# Altium project USB-C Charger.PrjPcb
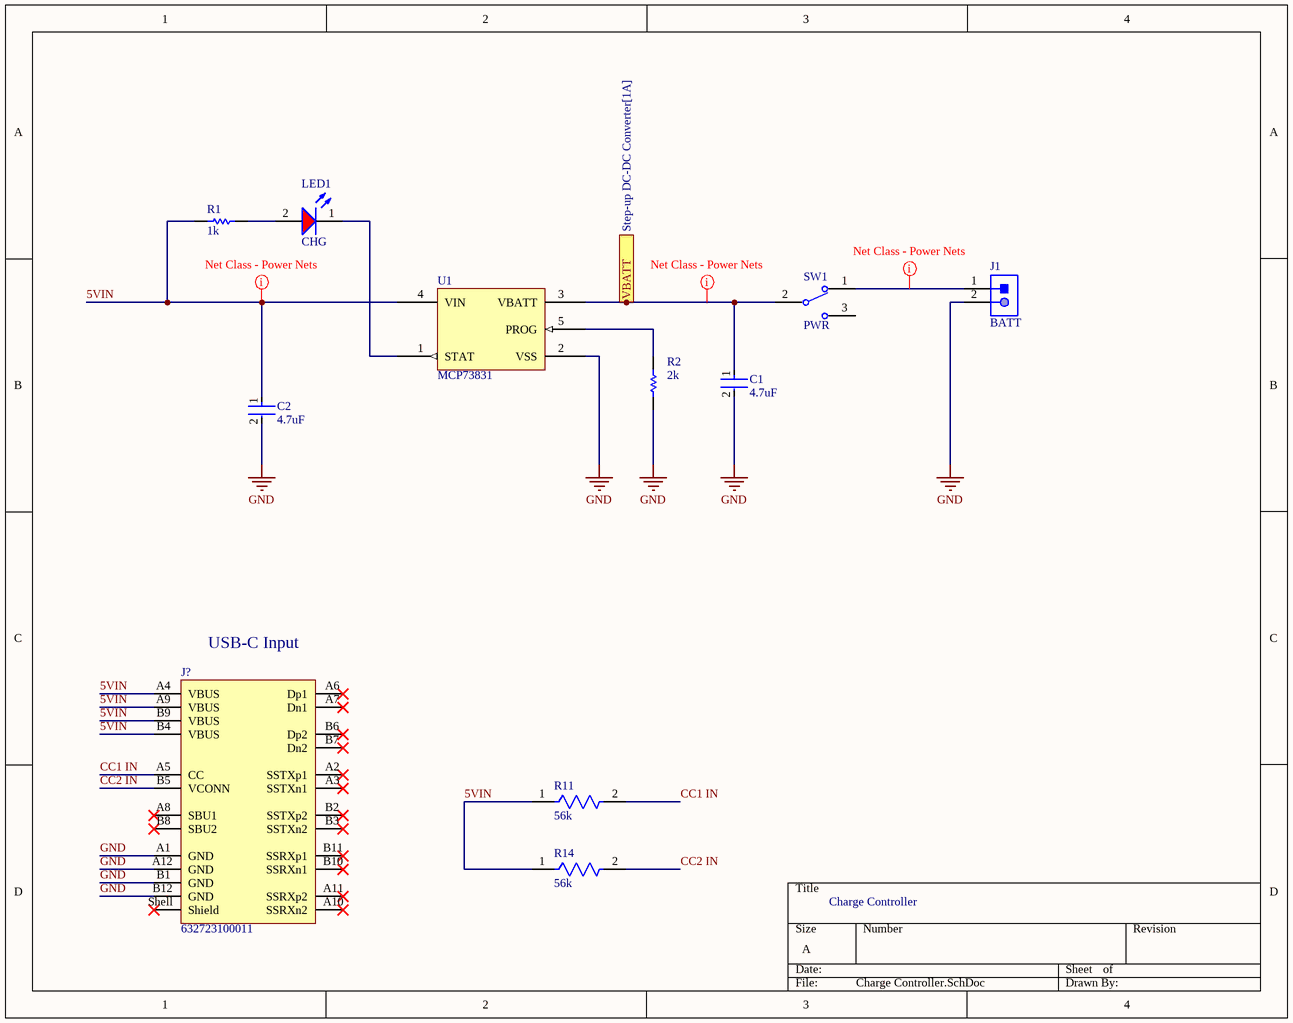
[diagram p0: Charge Controller.SchDoc]
2 sheets, 29 parts. Net scope: flat (ports and power ports of the same name join across sheets).
Board file: USB-C Charger.PcbDoc
Sheets:
  Charge Controller.SchDoc
  Step-up DC-DC Converter.SchDoc

## Sheet Charge Controller.SchDoc
size A; SheetNumber: 1; SheetTotal: 2

### Parts
C1  4.7uF  [FP-C0805C475K8PACTU-MFG]
C2  4.7uF  [FP-C0805C475K8PACTU-MFG]
IN  632723100011  [632723100011]
J1  BATT  [JST-S2B-PH-K-S_V]
LED1  CHG  [WL-SMCW_0805_150080xx75000]
R1  1k  [RESC2013X60X35ML10T20]
R2  2k  [RESC2013X60X35ML10T20]
R11  56k  [FP-CRCW0805-e3-IPC_B]
R14  56k  [FP-CRCW0805-e3-IPC_B]
SW1  PWR  [FP-JS102011JAQN-MFG]
U1  MCP73831  [SOT95P280X145-5N]

### Ports
VBATT (see Step-up DC-DC Converter[1A])

### Nets
GND: C1.2 C2.2 IN.A1(GND) IN.A12(GND) IN.B1(GND) IN.B12(GND) J1.2 R2.1 U1.2(VSS)
5VIN: C2.1 IN.A4(VBUS) IN.A9(VBUS) IN.B4(VBUS) IN.B9(VBUS) R1.1 R11.1 R14.1 U1.4(VIN)
CC1 IN: IN.A5(CC) R11.2
CC2 IN: IN.B5(VCONN) R14.2
NetC1_1: C1.1 SW1.2(C) U1.3(VBATT) ; port VBATT
NetJ1_1: J1.1 SW1.1
NetLED1_1: LED1.1(K) U1.1(STAT)
NetLED1_2: LED1.2(A) R1.2
NetR2_2: R2.2 U1.5(PROG)

Not connected (* = marked no-connect by the designer): IN A2(SSTXp1)* A3(SSTXn1)* A6(Dp1)* A7(Dn1)* A8(SBU1)* A10(SSRXn2)* A11(SSRXp2)* B2(SSTXp2)* B3(SSTXn2)* B6(Dp2)* B7(Dn2)* B8(SBU2)* B10(SSRXn1)* B11(SSRXp1)* Shell(Shield)*; SW1 3

### Layout directives
net class PowerNets: 5VIN, NetC1_1, NetJ1_1

### Notes on the sheet
- (near IN) USB-C Input
- Charge Controller

### Library data of the parts
C1 C2 = CMP-2007-01007-2: CAP CER 4.7UF 10V X5R 0805; Dielectric Material: Ceramic; Dissipation Factor: 5%; Tolerance: 10%; Lead Pitch: 0.75mm; Mount: Surface Mount; Voltage Rating (DC): 10V; Length: 2mm; Case Code (Imperial): 0805; Height: 1.25mm; Package Quantity: 1; Thickness: 0.055inch; Depth: 1.25mm; Case Code (Metric): 2012; Termination: SMD/SMT; Construction: Flat; Dielectric: X5R; Series: C; Capacitance: 4.7uF; Width: 1.2mm; Max Operating Temperature: 85°C; Packaging: Tape and Reel; Voltage Rating: 10V; REACH SVHC: No SVHC; Min Operating Temperature: -55°C; Number of Pins: 2; Case/Package: 0805; Radiation Hardening: No; Lead Free: Lead Free; Voltage: 10V; RoHS Compliant: Yes
IN = CMP-1502-03213-3: NexarPartId: 68112674; Voltage Rating: 20V; Gender: Receptacle; Current Rating: 5A; Pin Length: 1.5mm; Contact Resistance: 30mΩ; Connector Type: USB; USB Standard: USB 3.1; Insulation Resistance: 1GΩ; Number of Contacts: 24
J1 = CMP-1755-00004-1: Male Header, Pitch 2 mm, 1 x 2 Position, Height 4.8 mm, Tail Length 3.4 mm, -25 to 85 degC, RoHS, Bulk; Case\Package: Radial; Tolerance: 20%; Capacitance: 10 uF; Voltage Rating (DC): 50 V; Packaging: Bulk; ComponentLink1URL: http://www.jst-mfg.com/product/pdf/eng/ePH.pdf; Radiation Hardening: No; Height: 11 mm; Package Quantity: 200; PackageDescription: Male Header, Pitch 2 mm, 1 x 2 Position, Height 4.8 mm, Tail Length 3.4 mm; PackageReference: S2B-PH-K-S; Diameter: 5 mm; Pins: 2; Mount: Through Hole; Max Operating Temperature: 85 degC; Min Operating Temperature: -40 degC; ComponentLink1Description: Datasheet; DatasheetVersion: Dec-12; Length: 11 mm; Lead Pitch: 2 mm; REACH SVHC: No SVHC; Voltage Rating: 50 V; RoHSCompliant: true
LED1 = CMP-1426-00011-3: LED Uni-Color Red 630nm 2-Pin Chip 0805(2012Metric) T/R; Viewing Angle: 140°; Max Junction Temperature (Tj): 95°C; Power Dissipation: 72mW; Forward Current: 100mA; Forward Voltage: 2V; Wavelength: 625nm; Test Current: 20mA; Max Reverse Voltage (DC): 5V; Luminous Intensity: 150mcd; Lens Style: Clear, Rectangular; REACH SVHC: Unknown; Height: 700µm; Case Code (Metric): 2012; Peak Wavelength: 630nm; Length: 2mm; Width: 1.25mm; RoHS: Compliant; Packaging: Tape and Reel; Dominant Wavelength: 625nm; Color: Red; Case Code (Imperial): 0805; Min Operating Temperature: -40°C; Mount: Surface Mount; Max Operating Temperature: 85°C; Case/Package: 0805
R1 = CMP-2100-03671-1: Chip Resistor, 1 KOhm, +/- 1%, 125 mW, -55 to 155 degC, 0805 (2012 Metric), RoHS, Tape and Reel; Manufacturer: Yageo; Temperature Coefficient: 100ppm/degreesC; Voltage Rating (DC): 150V; Max Power Dissipation: 125mW; Resistance: 1KOhm; Number of Pins: 2; Number of Terminations: 2; Datasheet URL: http://www.yageo.com/NewPortal/yageodocoutput?fileName=/pdf/R-Chip/PYu-RC_Group_51_RoHS_L_5.pdf; Length: 0.079inch; Package Description: 2-Pin Surface Mounted Device, Body 2 x 1.25 mm; Depth: 1.25mm; Height: 0.024inch; Military Standard: Not; Case/Package: 0805; Package Reference: 0805; RoHSCompliant: true; Lead Free: LeadFree; Packaging: TapeandReel; Package Quantity: 1; Datasheet Version: Rev. 5, 10/2016; Tolerance: 1%; Min Operating Temperature: -55degC; Voltage Rating: 150V; Composition: ThickFilm; Case Code (Imperial): 0805; Power Rating: 125mW; Width: 0.049inch; Case Code (Metric): 2012; Manufacturer URL: http://www.yageo.com/; Max Operating Temperature: 155degC; REACH SVHC: Unknown; Termination: SMD/SMT
R2 = CMP-2001-01361-1: Manufacturer: Yageo; Part Number: RC0805JR-072KL
R11 R14 = CMP-2001-04015-2: RES Thick Film, 56kΩ, 1%, 0.125W, 100ppm/°C, 0805; Resistance: 56kR; Power Rating: 125mW; Voltage Rating: 150V; Depth: 1.25mm; Contact Plating: Tin; Package Quantity: 10; Min Operating Temperature: -55°C; Case/Package: 0805; Packaging: Tape and Reel; Lead Free: Lead Free; Case Code (Imperial): 0805; Tolerance: 1%; Height: 0.45mm; Max Operating Temperature: 155°C; Case Code (Metric): 2012; Number of Pins: 2; Width: 1.25mm; Mount: Surface Mount; Voltage Rating (DC): 150V; Max Power Dissipation: 125mW; Weight: 0.000194oz; Termination: SMD/SMT; Length: 2mm; Radiation Hardening: No; Composition: Thick Film; Features: Automotive AEC-Q200; Number of Terminations: 2; Temperature Coefficient: 100ppm/°C; Military Standard: Not
SW1 = CMP-10038-000001-1: SWITCH SLIDE SPDT 300MA 6V; Manufacturer: C&K; Manufacturer Part Number: JS102011JAQN; Contact Resistance: 70mΩ; Electromechanical Life: 5000Cycles; Device Class L2: Switches; Temperature Range Low: -40°C; Device Class L1: Electromechanical; RoHS: TRUE; Automotive: No; Throw Configuration: SPDT; Height: 3.5mm; Digikey Description: SWITCH SLIDE SPDT 300MA 6V; Device Class L3: Slide Switches; Temperature Range High: +85°C; Mouser Description: JS Series Sub-Miniature Slide Switch SPDT Right-Angle SMT; Mount: Surface Mount; ComponentLink2Description: Datasheet; Octopart: https://octopart.com/js102011jaqn-c%26k+components-74831566; Category: Switch; Contact Current Rating: 300mA; Temperature: -40°C to +85°C; Voltage Rating Dc: 6V; ComponentLink2URL: https://www.ckswitches.com/media/1422/js.pdf; Lead Free: Yes; Package: JS102011JAQN
U1 = MCP73831: Power Supply Support Circuit, Adjustable, 1 Channel, PDSO5; Manufacturer: Microchip; Manufacturer Part Number: MCP73831T-2ACI/OT; Package Body Material: Plastic; Adjustable Threshold: Yes; Number of Channels: 1; Package Equivalence Code: TSOP5/6,.11,37; Power Supplies: 3.3/5V; Supply Current-Max (Isup): 1.5mA; Max Supply Voltage: 6V; Min Supply Voltage: 3.75V; Time @ Peak Reflow Temperature-Max (s): 40s; Nominal Supply Voltage: 5.2V; Qualification Status: Not Qualified; Supplier: Arrow Electronics; Supplier Part Number: MCP73831T-2ACI/OT; RoHS: Yes; Category: Battery Management; Stock: 6000; Pricing: 3000=0.5836 (USD); Case/Package: LSSOP; Pins: 5; Package Shape: Rectangular; Terminal Finish: Tin; Min Operating Temperature: -40°C; Max Operating Temperature: 85°C; JESD-609 Code: e3; Throw Configuration: POWER SUPPLY SUPPORT CIRCUIT; JESD-30 Code: R-PDSO-G5; Moisture Sensitivity Level: 1; Channels: 1; Package Style: SMALL OUTLINE, LOW PROFILE, SHRINK PITCHMeter; Peak Reflow Temperature (Cel): 260°C; Surface Mount: Yes; Terminal Form: Gull Wing; Terminal Position: DUAL; Length: 2.95mm; Width: 1.65mm; Height - Seated (Max): 1.45mm; Terminal Pitch: 0.95mm; Temperature Grade: INDUSTRIAL; Reach SVHC Compliant: Yes; RoHS Compliant: Yes; ComponentLink1URL: https://datasheet.ciiva.com:443/pdfs/VipMasterIC/IC/MCHP/MCHPS05673/MCHPS05673-1.pdf?src-supplier=IHS+Markit; ComponentLink1Description: https://datasheet.ciiva.com:443/pdfs/VipMasterIC/IC/MCHP/MCHPS05673/MCHPS05673-1.pdf?src-supplier=IHS+Markit

## Sheet Step-up DC-DC Converter.SchDoc
size A; SheetNumber: 2; SheetTotal: 2
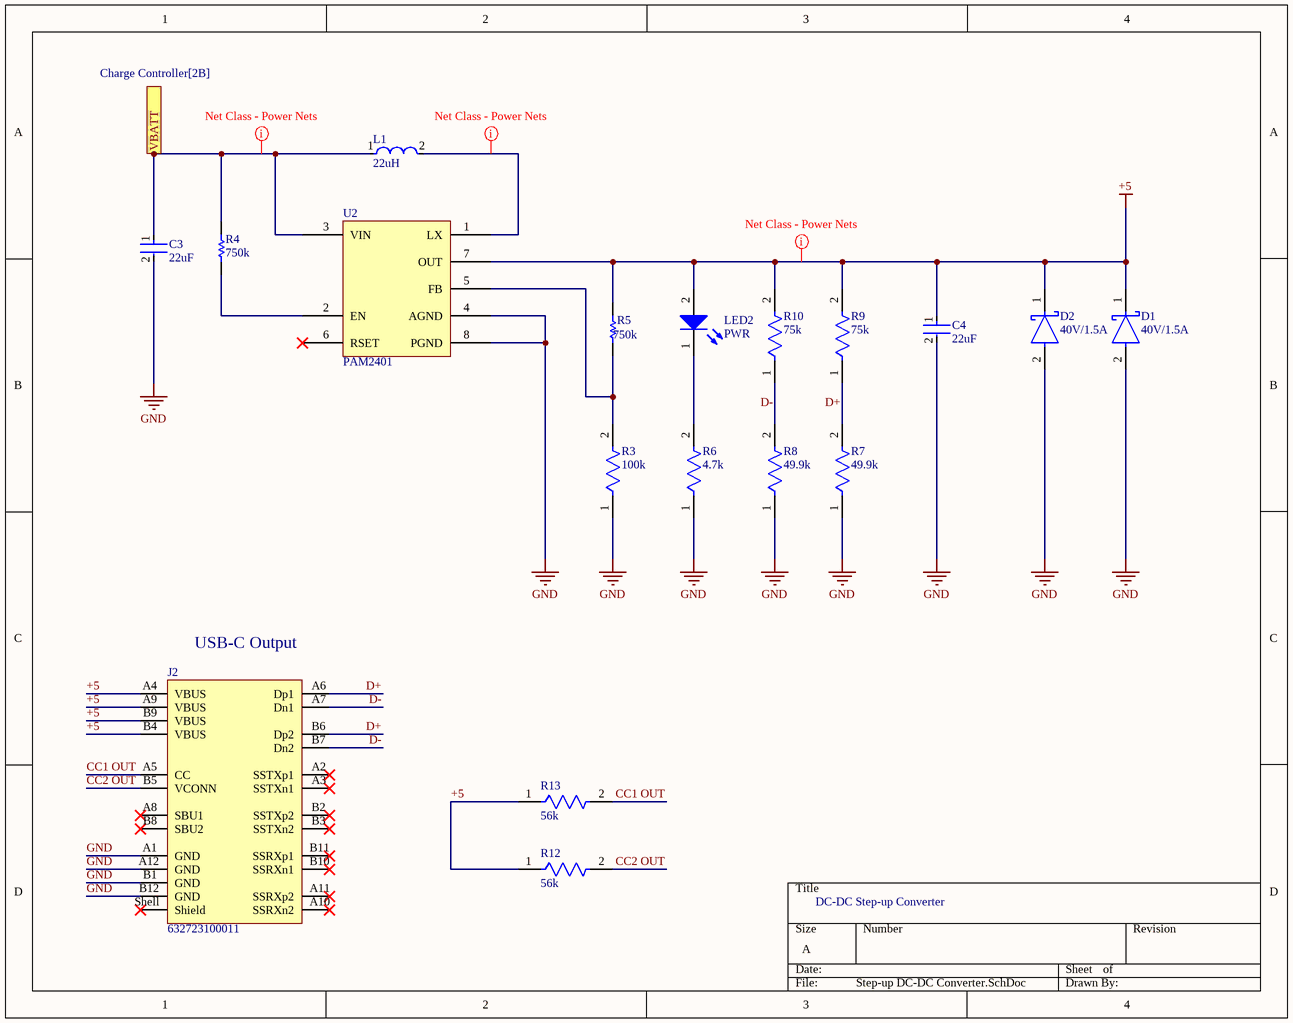
[diagram p1: Step-up DC-DC Converter.SchDoc]

### Parts
C3  22uF  [FP-GRM21B-0_15-MFG]
C4  22uF  [FP-GRM21B-0_15-MFG]
D1  40V/1.5A  [FP-95400-MFG]
D2  40V/1.5A  [FP-95400-MFG]
J2  632723100011  [632723100011]
L1  22uH  [FP-LQM2HPN_G0-IPC_C]
LED2  PWR  [WL-SMCW_0805_150080xx75000]
R3  100k  [FP-CRCW0805-e3-MFG]
R4  750k  [RESC2013X50X30LL20T20]
R5  750k  [RESC2013X50X30LL20T20]
R6  4.7k  [FP-CRCW0805-e3-IPC_B]
R7  49.9k  [FP-CRCW0805-e3-IPC_C]
R8  49.9k  [FP-CRCW0805-e3-IPC_C]
R9  75k  [FP-CRCW0805-e3-IPC_A]
R10  75k  [FP-CRCW0805-e3-IPC_A]
R12  56k  [FP-CRCW0805-e3-IPC_B]
R13  56k  [FP-CRCW0805-e3-IPC_B]
U2  PAM2401  [TSOP65P490X110-8N]

### Ports
VBATT (see Charge Controller[2B])

### Nets
+5: C4.1 D1.1(C) D2.1(C) J2.A4(VBUS) J2.A9(VBUS) J2.B4(VBUS) J2.B9(VBUS) LED2.2(A) R5.2 R9.2 R10.2 R12.1 R13.1 U2.7(OUT)
GND: C3.2 C4.2 D1.2(A) D2.2(A) J2.A1(GND) J2.A12(GND) J2.B1(GND) J2.B12(GND) R3.1 R6.1 R7.1 R8.1 U2.4(AGND) U2.8(PGND)
CC1 OUT: J2.A5(CC) R13.2
CC2 OUT: J2.B5(VCONN) R12.2
D+: J2.A6(Dp1) J2.B6(Dp2) R7.2 R9.1
D-: J2.A7(Dn1) J2.B7(Dn2) R8.2 R10.1
NetC1_1: C3.1 L1.1 R4.2 U2.3(VIN) ; port VBATT
NetL1_2: L1.2 U2.1(LX)
NetLED2_1: LED2.1(K) R6.2
NetR3_2: R3.2 R5.1 U2.5(FB)
NetR4_1: R4.1 U2.2(EN)

Not connected (* = marked no-connect by the designer): J2 A2(SSTXp1)* A3(SSTXn1)* A8(SBU1)* A10(SSRXn2)* A11(SSRXp2)* B2(SSTXp2)* B3(SSTXn2)* B8(SBU2)* B10(SSRXn1)* B11(SSRXp1)* Shell(Shield)*; U2 6(RSET)*

### Layout directives
net class PowerNets: +5, NetC1_1, NetL1_2

### Notes on the sheet
- (near J2) USB-C Output
- DC-DC Step-up Converter

### Library data of the parts
C3 C4 = CMP-2007-03385-2: Chip Multilayer Ceramic Capacitors for General Purpose, 0805, 22uF, X5R, 15%, 20%, 6.3V; Material: Ceramic; Max Operating Temperature: 85°C; Voltage: 6.3V; Min Operating Temperature: -55°C; Case/Package: 0805; Thickness: 0.053inch; Dielectric: X5R; Packaging: Tape and Reel; Depth: 1.25mm; Termination: SMD/SMT; Voltage Rating (DC): 6.3V; Radiation Hardening: No; Tolerance: 20%; Mount: Surface Mount; Lead Free: Lead Free; Package Quantity: 1; REACH SVHC: No SVHC; Voltage Rating: 6.3V; Capacitance: 22uF; Length: 2mm; Case Code (Imperial): 0805; Case Code (Metric): 2012; Width: 0.049inch; Height: 1.25mm
D1 D2 = CMP-02539-000025-1: DIODE SCHOTTKY 40V 1.5A SMA; Manufacturer: Vishay; Manufacturer Part Number: VS-15MQ040NTRPBF; Standoff Height: 0mm; Capacitance: 134pF; Peak Reverse Current: 0.5mA; Max Junction Temp: +150°C; Value: 134pF; Max Surge Forward Current: 140A; RoHS: TRUE; Lead Free: Yes; Octopart: https://octopart.com/vs-15mq040ntrpbf-vishay-44340959; Max Repetitive Reverse Voltage: 40V; Device Class L1: Discrete Semiconductors; ComponentLink2URL: http://www.vishay.com/docs/94141/vs-15mq040ntrpbf.pdf; Reverse Voltage: 40V; ComponentLink2Description: Datasheet; Forward Current: 1.5A; Temperature: -40°C to +150°C; Digikey Description: DIODE SCHOTTKY 40V 1.5A SMA; Height: 2.29mm; Category: Diode; Footprint Url: http://www.vishay.com/docs/95400/sma.pdf; Device Class L2: Diodes; Device Class L3: Schottky Diodes; Mouser Description: Schottky Diodes & Rectifiers 2.1 Amp 40 Volt; Automotive: No; Package: 95400; Temperature Range Low: -40°C; Temperature Range High: +150°C
J2 = CMP-1502-03213-3: as IN on sheet Charge Controller; Contact Material: Gold, Nickel; Max Operating Temperature: 105°C; Packaging: Tape and Reel; Height: 3.16mm; RoHS: Compliant; Orientation: Horizontal; Mount: Surface Mount, Through Hole; Number of Pins: 24; Min Operating Temperature: -40°C
L1 = CMP-06042-017002-1: Multilayer Type Inductor for Power Lines, 1008 (2520), 2.2μH, 20%, 0.225Ω, 1100mA; Current Rating: 1.1A; Test Frequency: 1MHz; Inductance: 2.2uH; Self Resonant Frequency: 40MHz; Shielding: Shielded; DC Resistance (DCR): 225mR; Length: 0.098inch; Package Quantity: 3000; Height - Seated (Max): 0.039inch; Packaging: Tape and Reel; Width: 0.079inch; Max Operating Temperature: 85°C; Tolerance: 20%; RoHS Compliant: Yes; Case/Package: 1008; Min Operating Temperature: -40°C; Mount: Surface Mount
LED2 = CMP-1426-00008-7: Led, Blue, 470 Nm, 3.2 V, 30 Ma, 145 Mcd Rohs Compliant: Yes; Dominant Wavelength: 470nm; Max Junction Temperature (Tj): 95°C; Power Dissipation: 105mW; Peak Wavelength: 465nm; Max Reverse Voltage (DC): 5V; Forward Current: 100mA; Test Current: 20mA; Luminous Intensity: 145mcd; Lens Style: Clear, Rectangular; Viewing Angle: 140°; Forward Voltage: 3.2V; Color: Blue; Height: 700µm; Case Code (Imperial): 0805; Width: 1.25mm; REACH SVHC: Unknown; Case/Package: 0805; Lead Free: Lead Free; Mount: Surface Mount; Packaging: Tape and Reel; RoHS: Compliant; Reverse Voltage: 5V; Min Operating Temperature: -40°C; Case Code (Metric): 2012; Wavelength: 470nm; Max Operating Temperature: 85°C; Length: 2mm
R3 = CMP-2001-04899-2: RES Thick Film, 100kΩ, 1%, 0.125W, 100ppm/°C, 0805; Resistance: 100kR; Power Rating: 125mW; Voltage Rating: 150V; Case/Package: 0805; Max Operating Temperature: 155°C; Case Code (Imperial): 0805; Lead Free: Lead Free; Weight: 0.000194oz; Number of Pins: 2; Package Quantity: 5000; Height: 0.45mm; Composition: Thick Film; Military Standard: Not; Tolerance: 1%; Case Code (Metric): 2012; Termination: SMD/SMT; Mount: Surface Mount; Radiation Hardening: No; Width: 1.25mm; Length: 2mm; Depth: 1.25mm; Packaging: Tape and Reel; Min Operating Temperature: -55°C; Contact Plating: Tin; Temperature Coefficient: 100ppm/°C; Voltage Rating (DC): 150V
R4 R5 = CMP-2001-04102-1: Manufacturer: Vishay Dale; Part Number: CRCW0805750KFKEA
R6 = CMP-2100-03615-2: RES Thick Film, 4.7kΩ, 1%, 0.125W, 100ppm/°C, 0805; Max Power Dissipation: 125mW; Resistance: 4.7kR; Voltage Rating: 150V; Termination: SMD/SMT; Weight: 0.000194oz; Case/Package: 0805; Number of Terminations: 2; Min Operating Temperature: -55°C; Case Code (Metric): 2012; Package Quantity: 10; Depth: 1.25mm; Military Standard: Not; Composition: Thick Film; Radiation Hardening: No; Contact Plating: Tin; Height: 0.45mm; Power Rating: 125mW; Features: Automotive AEC-Q200; Tolerance: 1%; Packaging: Tape and Reel; Max Operating Temperature: 155°C; Length: 2mm; Case Code (Imperial): 0805; Voltage Rating (DC): 150V; Width: 1.25mm; Temperature Coefficient: 100ppm/°C; Lead Free: Lead Free
R7 R8 = CMP-2001-03952-2: RES Thick Film, 49.9kΩ, 1%, 0.125W, 100ppm/°C, 0805; Resistance: 49.9kR; Power Rating: 125mW; Voltage Rating (DC): 150V; Contact Plating: Tin; Case Code (Imperial): 0805; Package Quantity: 10; Termination: SMD/SMT; Length: 2mm; Width: 0.049inch; Case Code (Metric): 2012; Temperature Coefficient: 100ppm/°C; Tolerance: 1%; Depth: 1.25mm; Mount: Surface Mount; Lead Free: Lead Free; Min Operating Temperature: -55°C; Case/Package: 0805; Number of Terminations: 2; Composition: Thick Film; Height: 0.45mm; Voltage Rating: 150V; Max Power Dissipation: 125mW; Features: Automotive AEC-Q200; Military Standard: Not; Radiation Hardening: No; Max Operating Temperature: 155°C; Weight: 0.000194oz; Packaging: Tape and Reel
R9 R10 = CMP-2001-04106-2: RES Thick Film, 75kΩ, 1%, 0.125W, 100ppm/°C, 0805; Voltage Rating: 150V; Power Rating: 125mW; Resistance: 75kR; Series: CRCW; Packaging: Tape and Reel; Width: 0.049inch; Package Quantity: 10; Max Operating Temperature: 155°C; Height: 0.45mm; Temperature Coefficient: 100ppm/°C; Resistor Type: Thick Film; Case Code (Metric): 2012; RoHS Compliant: Yes; Military Standard: Not; Weight: 0.000194oz; Mount: Surface Mount; Depth: 1.25mm; Max Power Dissipation: 125mW; Tolerance: 1%; Lead Free: Lead Free; Working Voltage: 150V; Technology: THICK FILM; Radiation Hardening: No; Termination: SMD/SMT; Number of Terminations: 2; Number of Pins: 2; Features: Automotive AEC-Q200; Case Code (Imperial): 0805; Resistance Tolerance: 1%; Min Operating Temperature: -55°C; Voltage Rating (DC): 150V; Contact Plating: Tin; Case/Package: 0805; Construction: Rectangular; Length: 2mm
R12 R13 = CMP-2001-04015-2: as R11 on sheet Charge Controller; Depth: 1.25mm; Contact Plating: Tin; Package Quantity: 10; Min Operating Temperature: -55°C; Case/Package: 0805; Packaging: Tape and Reel; Lead Free: Lead Free; Case Code (Imperial): 0805; Tolerance: 1%; Height: 0.45mm; Max Operating Temperature: 155°C; Case Code (Metric): 2012; Number of Pins: 2; Width: 1.25mm; Mount: Surface Mount; Voltage Rating (DC): 150V; Max Power Dissipation: 125mW; Weight: 0.000194oz; Termination: SMD/SMT; Length: 2mm; Radiation Hardening: No; Composition: Thick Film; Features: Automotive AEC-Q200; Number of Terminations: 2; Temperature Coefficient: 100ppm/°C; Military Standard: Not
U2 = PAM2401: 1.0MHz STEP-UP DC-DC CONVERTER

## Nets that join several sheets
GND: Charge Controller (9 pins), Step-up DC-DC Converter (14 pins)
NetC1_1: Charge Controller (C1.1 SW1.2 U1.3), Step-up DC-DC Converter (C3.1 L1.1 R4.2 U2.3)